# EAGLE design bitMossWIFI (EAGLE 6.1)
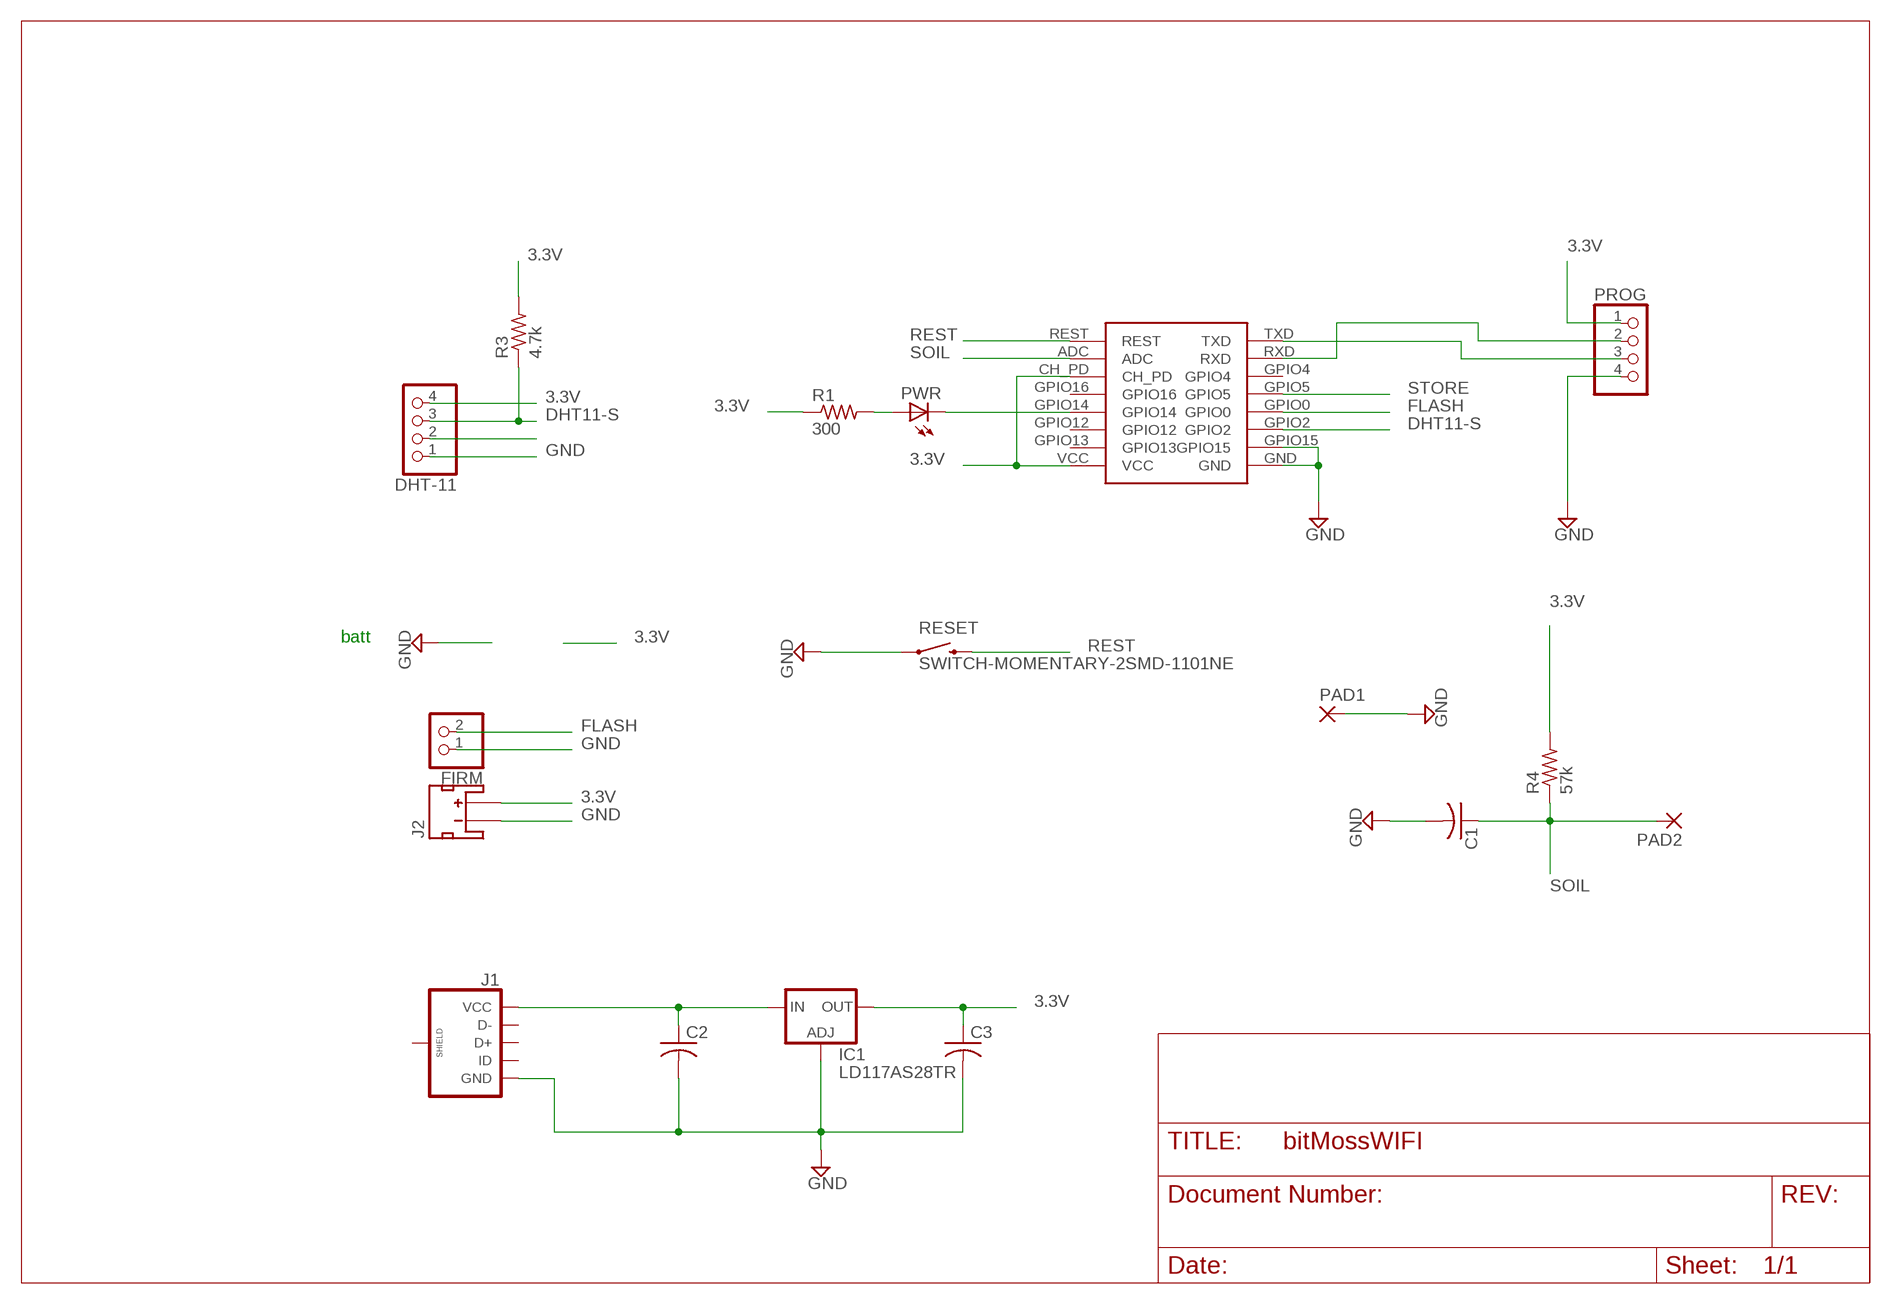
[diagram p0: schematic, sheet 1]

## Parts
C1  C-USC1210  [C1210]
C2  C-USC3216  [C3216]
C3  C-USC3216  [C3216]
DHT-11  PINHD-1X4  [1X04]
FIRM  PINHD-1X2  [1X02]
IC1  LD117AS28TR  [SOT223]
J1  USB_MICROB_PLUGCONN-11752  [USB-B-MICRO-SMD_V03]
J2  JST_2MM_MALE  [JST-2-SMD]
PAD1  SMD5  [SMD2,54-5,08]
PAD2  SMD5  [SMD2,54-5,08]
PROG  PINHD-1X4  [1X04]
PWR  LEDCHIPLED_1206  [CHIPLED_1206]
R1  300  R-US_R2012  [R2012]
R3  4.7k  R-US_R2012  [R2012]
R4  57k  R-US_R2012  [R2012]
RESET  SWITCH-MOMENTARY-2SMD-1101NE  [TACTILE-SWITCH-1101NE]
U$2  ESP-07  [ESP-07]

## Nets
3.3V: C3.1 DHT-11.4 IC1.4(OUT) J2.2(+) PROG.1 R1.1 R3.2 R4.2 U$2.CH_PD U$2.VCC
DHT11-S: DHT-11.3 R3.1 U$2.GPIO2
FLASH: FIRM.2 U$2.GPIO0
GND: C1.2 C2.2 C3.2 DHT-11.1 FIRM.1 IC1.1(ADJ) J1.GND J2.1(-) PAD1.1(P) PROG.4 RESET.1 U$2.GND U$2.GPIO15
N$1: PWR.C U$2.GPIO14
N$2: PWR.A R1.2
N$3: C2.1 IC1.3(IN) J1.VBUS(VCC)
N$4: PROG.3 U$2.TXD
N$5: PROG.2 U$2.RXD
N$8: DHT-11.2
REST: RESET.2 U$2.REST
SOIL: C1.1 PAD2.1(P) R4.1 U$2.ADC
STORE: U$2.GPIO5
Unconnected: J1.D+ J1.D- J1.ID J1.SHIELD1(SHIELD) J1.SHIELD2(SHIELD) J1.SHIELD3(SHIELD) J2.NC1(PAD1) J2.NC2(PAD2) U$2.GPIO4 U$2.GPIO12 U$2.GPIO13 U$2.GPIO16

## Notes on the sheet
- batt

## Library data of the parts
C1-C3 = rcl:C-US: CAPACITOR, American symbol
DHT-11 PROG = pinhead:PINHD-1X4: PIN HEADER
FIRM = pinhead:PINHD-1X2: PIN HEADER
IC1 = v-reg:LD117A?*: Low drop fixed and adjustable positive voltage regulators 1 A Source: http://www.st.com/stonline/products/literature/ds/7194/ld1117axx.pdf
J1 = SparkFun-Connectors:USB_MICROB_PLUG: USB Micro-B connectors Some male, some female. Watch your step!; PROD_ID: CONN-11752
J2 = SparkFun-Connectors:JST_2MM_MALE: Mates to single-cell LiPo batteries. CONN-11443 Now with smashable polarity marks!; BTM_NEG: -; BTM_POS: +; PROD_ID: CONN-11443; TOP_NEG: -; TOP_POS: +
PAD1 PAD2 = wirepad:SMD5: SMD PAD
PWR = adafruit:LED: LED OSRAM: - CHIPLED LG R971, LG N971, LY N971, LG Q971, LY Q971, LO R971, LY R971 LH N974, LH R974 LS Q976, LO Q976, LY Q976 LO Q996 - Hyper CHIPLED LW Q18S LB Q993, LB Q99A, LB R99A - SideLED LS A670, LO A670, LY A670, LG A670, LP A670 LB A673, LV A673, LT A673, LW A673 LH A674 LY A675 LS A676, LA A676, LO A676, LY A676, LW A676 LS A679, LY A679, LG A679 - Hyper Micro SIDELED® LS Y876, LA Y876, LO Y876, LY Y876 LT Y87S - SmartLED LW L88C, LW L88S LB L89C, LB L89S, LG L890 LS L89K, LO L89K, LY L89K LS L896, LA L896, LO L896, LY L896 - TOPLED LS T670, LO T670, LY T670, LG T670, LP T670 LSG T670, LSP T670, LSY T670, LOP T670, LYG T670 LG T671, LOG T671, LSG T671 LB T673, LV T673, LT T673, LW T673 LH T674 LS T676, LA T676, LO T676, LY T676, LB T676, LH T676, LSB T676, LW T676 LB T67C, LV T67C, LT T67C, LS T67K, LO T67K, LY T67K, LW E67C LS E67B, LA E67B, LO E67B, LY E67B, LB E67C, LV E67C, LT E67C LW T67C LS T679, LY T679, LG T679 LS T770, LO T770, LY T770, LG T770, LP T770 LB T773, LV T773, LT T773, LW T773 LH T774 LS E675, LA E675, LY E675, LS T675 LS T776, LA T776, LO T776, LY T776, LB T776 LHGB T686 LT T68C, LB T68C - Hyper Mini TOPLED® LB M676 - Mini TOPLED Santana® LG M470 LS M47K, LO M47K, LY M47K Source: http://www.osram.convergy.de/
R1 R3 R4 = rcl:R-US_: RESISTOR, American symbol
RESET = SparkFun-Electromechanical:SWITCH-MOMENTARY-2: Various NO switches- pushbuttons, reed, etc; PROD_ID: SWCH-00815
U$2 = Makezone:ESP-07

## Net classes
0 default: width 0.762 mm

## Board
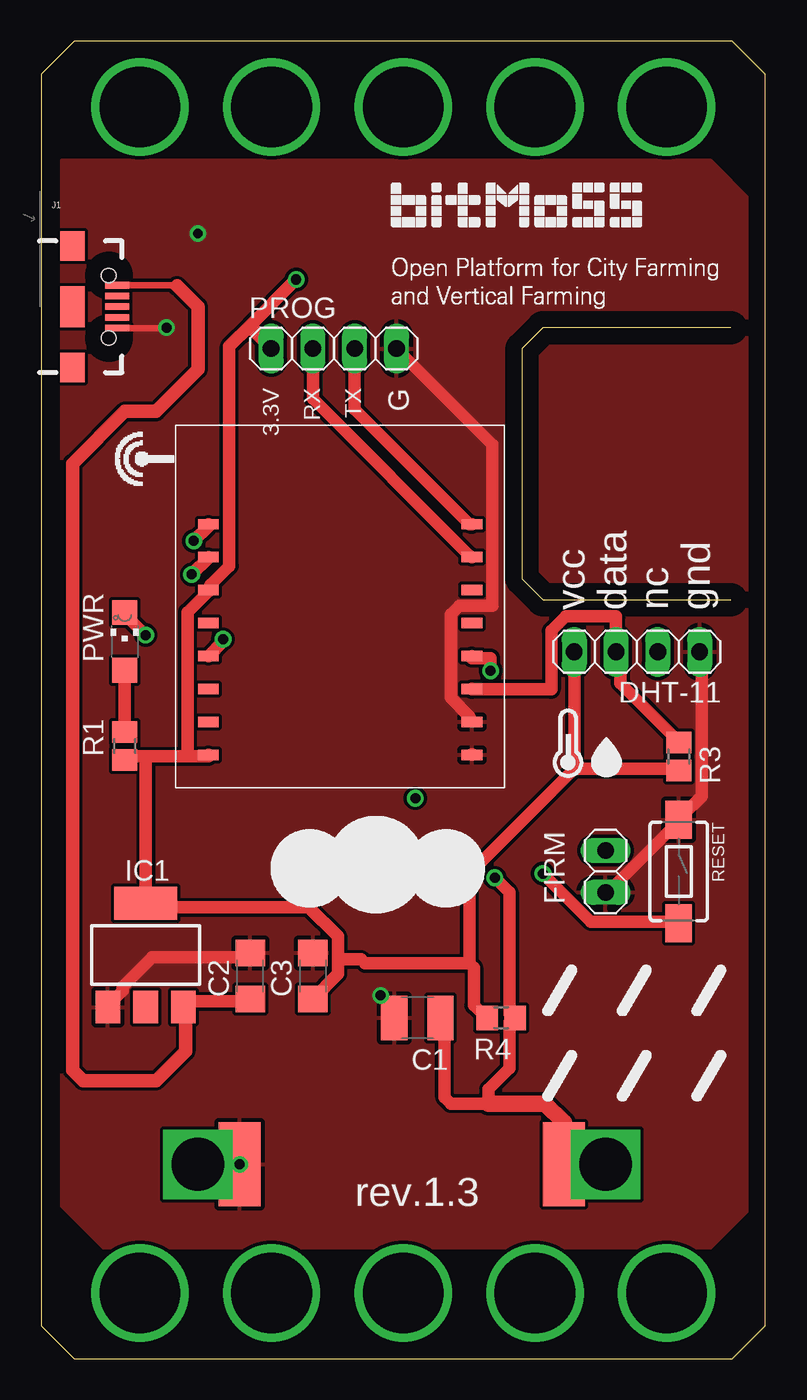
[diagram p1: board, top side]
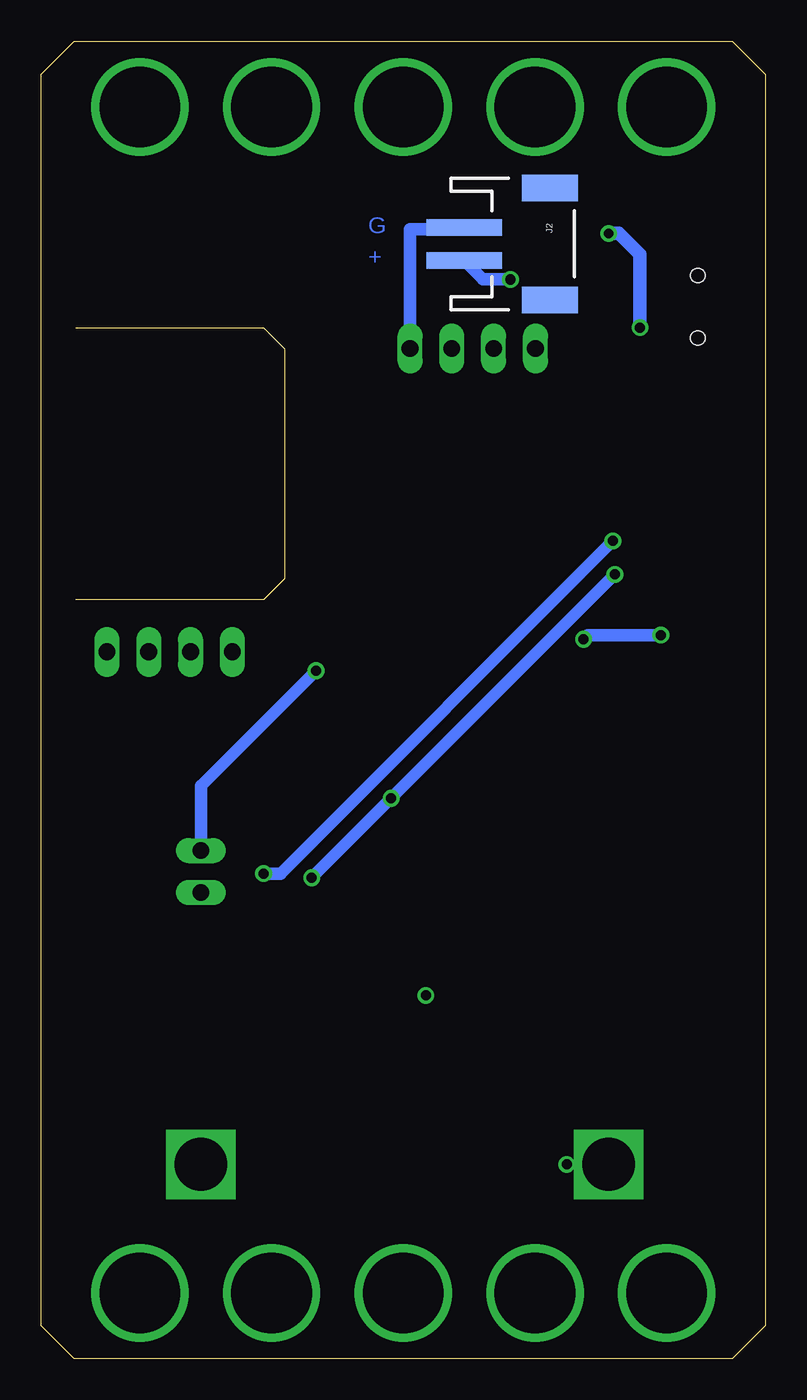
[diagram p2: board, bottom side, seen from below]

Size 44 x 80 mm. Coordinates in mm from the lower left corner, seen from the top.
Outline: 41.91,62.61 30.48,62.61 29.21,61.34 29.21,47.37 30.48,46.1 41.91,46.1
Outline: 0,2 2,0 42,0 44,2 44,78 42,80 2,80 0,78 0,2
Copper layers (1*16): Top 0.035mm / dielectric 1.5mm / Bottom 0.035mm
Design rules: minimum track width 10mil, minimum drill 24mil, track to track 8mil, track to pad 8mil, pad to pad 8mil, via to via 8mil, smd to smd 8mil, copper to edge 40mil, drill to drill 8mil, minimum pad ring 10mil, minimum via ring 8mil, stop-mask expansion 4mil, vias tented up to drill 0mil, thermal gap 10mil

### Footprints (pad centres in the part's own frame; a part is rotated, then mirrored left to right if it is on the bottom)
C1210 = smd 1.6 x 2.7: 1 -1.4,0; 2 1.4,0
C3216 = smd 1.6 x 1.8: 1 -1.4,0; 2 1.4,0
1X04 = drill 1.016 long: 1 -3.81,0; 2 -1.27,0; 3 1.27,0; 4 3.81,0
1X02 = drill 1.016 long: 1 -1.27,0; 2 1.27,0
SOT223 = smd 1.5 x 2: 1 -2.3,-3.15; 2 0,-3.15; 3 2.3,-3.15 | smd 3.8 x 2: 4 0,3.15
USB-B-MICRO-SMD_V03 = smd 1.45 x 0.4: D+ 2.725,0; D- 2.725,0.65; GND 2.725,-1.3; ID 2.725,-0.65; VBUS 2.725,1.3 | smd 1.5 x 1.8: SHIELD1 0,3.685; SHIELD2 0,-3.685 | smd 1.5 x 2.5: SHIELD3 0,0 | hole 0.85: 2.2,1.9; 2.2,-1.9
JST-2-SMD = smd 1 x 4.6: 1 -1,-3.7; 2 1,-3.7 | smd 1.6 x 3.4: NC1 -3.4,1.5; NC2 3.4,1.5
SMD2,54-5,08 = smd 2.54 x 5.08: 1 0,0
CHIPLED_1206 = smd 1.5 x 1.5: A 0,-1.75; C 0,1.75
R2012 = smd 1.3 x 1.5: 1 -0.85,0; 2 0.85,0
TACTILE-SWITCH-1101NE = smd 2.3 x 1.6: 1 -3.15,0; 2 3.15,0
ESP-07 = smd 1.27 x 0.635: ADC 0,14; CH_PD 0,12; GND 16,2; GPIO0 16,8; GPIO2 16,6; GPIO4 16,12; GPIO5 16,10; GPIO12 0,6; GPIO13 0,4; GPIO14 0,8; GPIO15 16,4; GPIO16 0,10; REST 0,16; RXD 16,14; TXD 16,16; VCC 0,2

### Placement (x,y rotation side)
C1  22.86,20.7 180 top
C2  12.7,23.24 90 top
C3  16.51,23.24 90 top
DHT-11  36.2,42.92 180 top
FIRM  34.29,29.59 90 top
IC1  6.35,24.51 0 top
J1  1.91,63.88 0 top
J2  14.61,67.69 270 bottom
PAD1  12.06,11.81 0 top
PAD2  31.75,11.81 0 top
PROG  17.78,61.34 0 top
PWR  5.08,43.56 0 top
R1  5.08,37.21 90 top
R3  38.73,36.58 270 top
R4  27.94,20.7 180 top
RESET  38.73,29.59 270 top
U$1  [BITMOSS_S_TITLE]  21.27,62 0 top
U$2  10.16,34.67 0 top
U$3  [TINYFARMER-HUMI_TEMP]  31.11,35.3 0 top
U$4  [TINYFARMER-RAIN1]  30.48,15.62 0 top
U$5  [TINYFARMER-CLOUD]  13.97,27.05 0 top
U$6  [CREBBOX_V_RF]  4.45,56.26 270 top

### Tracks (layer width: path | path; a pad name or v marks a point on that pad's centre or on a via)
3.3V  (via drill 0.61)
  Top 0.762: 32.38,35.81 38.73,35.81 R3.2 | DHT-11.4 32.38,35.81 | 18.03,24.26 19.43,24.26 19.68,24 26.04,24 | 18.03,24.26 18.03,23.37 C3.1 | 32.38,35.81 26.04,29.46 26.04,24 | 6.35,36.58 5.08,36.58 R1.1 | 6.35,36.58 8.89,36.58 | 8.89,36.58 10.16,36.58 U$2.VCC | 8.89,36.58 8.89,45.34 10.16,46.61 U$2.CH_PD 10.29,46.99 11.43,48.13 11.43,61.47 12.7,62.74 | 6.35,36.58 IC1.4 6.6,27.43 16.26,27.43 18.03,25.65 18.03,24.26 | 12.7,62.74 v15.49,65.53 | PROG.1 12.95,62.36 12.95,62.48 12.7,62.74 | R4.2 27.05,20.7 26.29,21.46 26.29,23.75 26.04,24
  Bottom 0.762: v15.49,65.53 17.14,65.53 18.29,66.67 J2.2
DHT11-S
  Top 0.762: U$2.GPIO2 26.16,40.64 30.99,40.64 30.99,44.2 31.88,45.08 34.92,45.08 DHT-11.3 35.18,42.67 35.18,41.02 38.73,37.46 R3.1
FLASH  (via drill 0.61)
  Top 0.762: v27.3,41.78 27.3,42.54 26.16,42.54 U$2.GPIO0
  Bottom 0.762: v27.3,41.78 34.29,34.8 FIRM.2
GND  (via drill 0.6)
  Top 0.406: J1.GND 7.59,62.58 v7.62,62.61 | 26.16,36.7 26.2,36.7 26.25,36.75
  Top 0.762: IC1.1 4.06,21.46 4.95,22.35 4.95,22.61 6.73,24.38 12.45,24.38 C2.2 | FIRM.1 34.42,28.32 38.73,32.64 RESET.1 38.99,33.02 40.13,34.16 40.13,42.67 DHT-11.1 | 26.16,36.7 U$2.GND | 26.04,38.99 24.89,40.13 24.89,45.21 25.4,45.72 27.43,45.72 27.43,55.5 PROG.4 | 20.7,22.1 v20.62,22.06
  Bottom 0.762: PROG.4 21.59,68.58 18.41,68.58 J2.1 | v20.62,22.06 20.7,22.1 20.64,22.14
  Bottom 0.813: v7.62,62.61 7.62,67.06 8.89,68.33 v9.53,68.33
  other vias: 12.06,11.81
  pour Top: 1.27,72.77 40.64,72.77 43.18,70.23 43.18,9.27 40.64,6.73 3.81,6.73 1.27,9.27
N$1  (via drill 0.61)
  Top 0.762: v11.05,43.69 11.05,43.56 U$2.GPIO14 | v6.35,43.94 5.08,45.21 PWR.C
  Bottom 0.762: v11.05,43.69 10.79,43.94 v6.35,43.94
N$2
  Top 0.762: PWR.A R1.2
N$3
  Top 0.406: J1.VBUS 8.22,65.18 8.26,65.15
  Top 0.762: C2.1 12.7,21.72 8.76,21.72 8.76,21.46 IC1.3
  Top 0.813: 8.76,21.72 8.76,18.67 6.99,16.89 2.54,16.89 1.91,17.52 1.91,54.35 5.08,57.53 6.99,57.53 9.53,60.07 9.53,63.88 8.26,65.15
N$4
  Top 0.762: PROG.3 19.05,57.66 26.04,50.67 U$2.TXD
N$5
  Top 0.762: PROG.2 16.51,58.29 26.04,48.77 U$2.RXD
N$6  (via drill 4.9)
  other vias: 6,76
N$7  (via drill 4.9)
  other vias: 14,76
N$9  (via drill 4.9)
  other vias: 22,76
N$10  (via drill 4.9)
  other vias: 30,76
N$11  (via drill 4.9)
  other vias: 38,76
N$12  (via drill 4.9)
  other vias: 38,4
N$13  (via drill 4.9)
  other vias: 30,4
N$14  (via drill 4.9)
  other vias: 22,4
N$15  (via drill 4.9)
  other vias: 14,4
N$16  (via drill 4.9)
  other vias: 6,4
N$17  (via drill 3.2)
  other vias: 9.53,11.81
N$18  (via drill 3.2)
  other vias: 34.29,11.81
REST  (via drill 0.61)
  Top 0.762: v9.27,49.66 10.16,50.55 U$2.REST | v30.48,29.46 33.4,26.54 38.73,26.54 RESET.2
  Bottom 0.762: v9.27,49.66 29.46,29.46 v30.48,29.46
SOIL  (via drill 0.61)
  Top 0.762: v9.14,47.62 10.16,48.64 U$2.ADC | C1.1 24.51,20.45 24.51,15.87 24.89,15.49 27.18,15.49 27.18,16.38 28.45,17.65 28.45,20.45 28.7,20.7 R4.1 28.45,20.95 28.45,28.32 v27.56,29.21
  Top 1.016: 27.18,15.49 30.61,15.49 31.75,14.35 PAD2.1
  Bottom 0.762: v9.14,47.62 v22.73,34.03 v27.56,29.21

### Text on the board
Bottom: G | +
tPlace: 3.3V | RX | TX | G | vcc | data | nc | gnd | rev.1.3